# Altium schematic sheet CPU.SchDoc
size A4
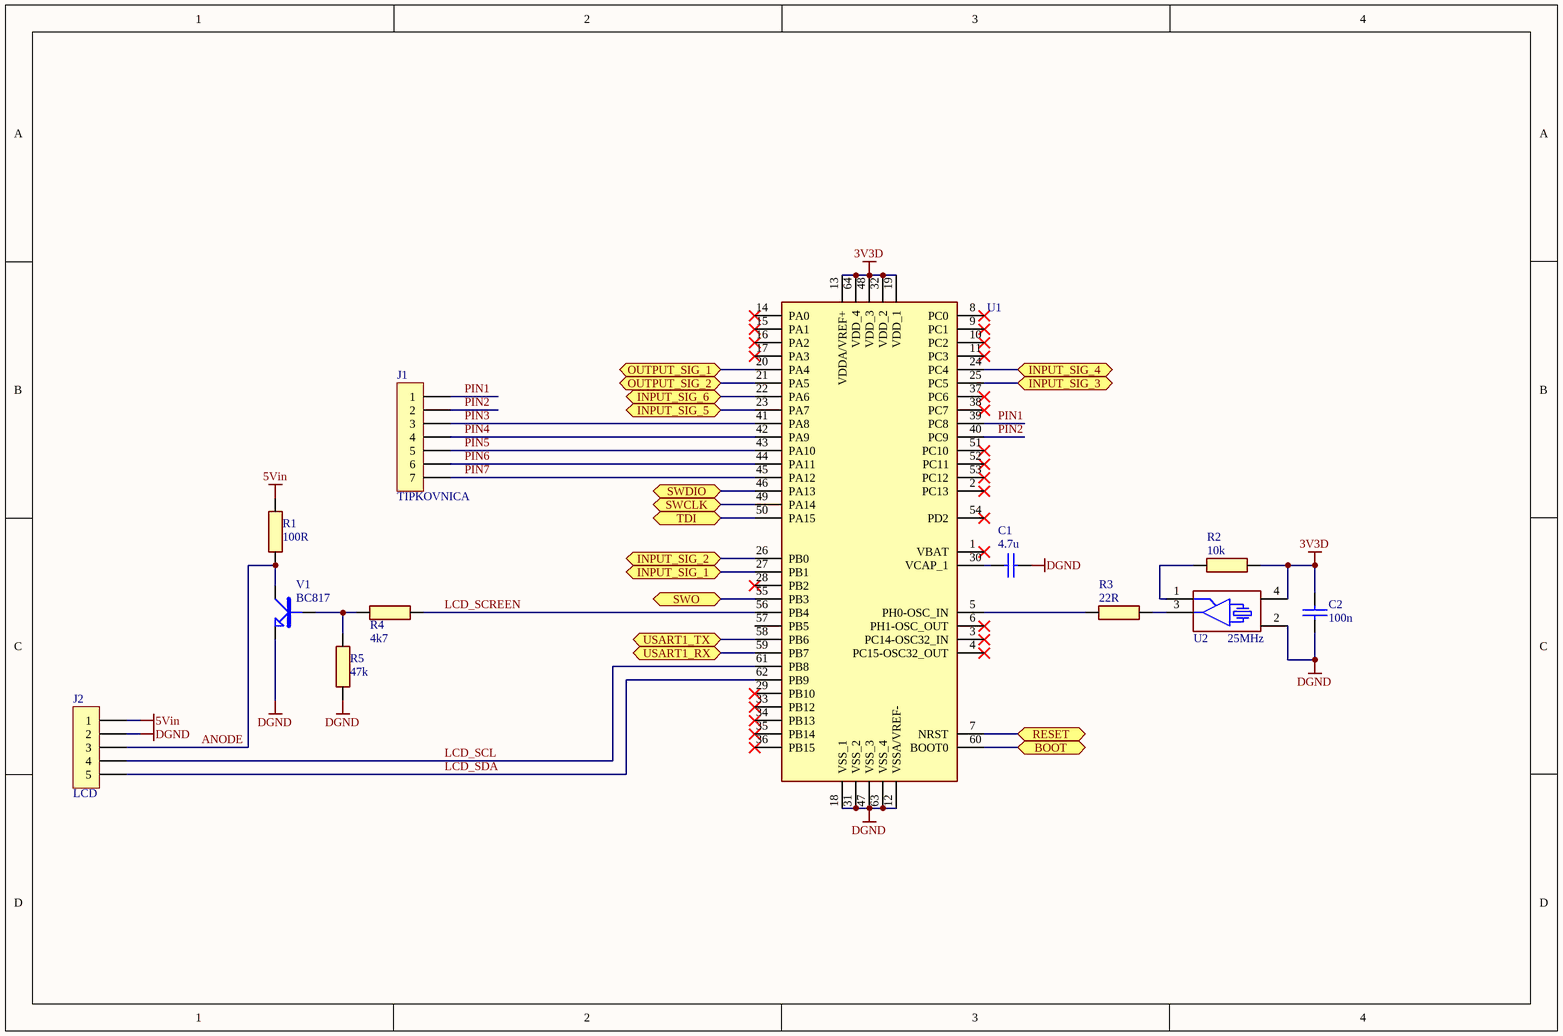
[diagram p0: CPU.SchDoc]

## Parts
C1  4.7u  [CAP_0805_SMD]
C2  100n  [CAP_0805_SMD]
J1  TIPKOVNICA  [CON-SIP-7]
J2  LCD  [CON-SIP-5]
R1  100R  [RES_0805_SMD]
R2  10k  [RES_0805_SMD]
R3  22R  [RES_0805_SMD]
R4  4k7  [RES_0805_SMD]
R5  47k  [RES_0805_SMD]
U1  STM32F446RE  [STM32F446RE]  (value not drawn)
U2  25MHz  [AQ-7050]
V1  BC817  [SOT-23_P]

## Ports
BOOT (bidir), INPUT_SIG_1 (bidir), INPUT_SIG_2 (bidir), INPUT_SIG_3 (bidir), INPUT_SIG_4 (bidir), INPUT_SIG_5 (bidir), INPUT_SIG_6 (bidir), OUTPUT_SIG_1 (bidir), OUTPUT_SIG_2 (bidir), RESET (bidir), SWCLK (bidir), SWDIO (bidir), SWO (bidir), TDI (bidir), USART1_RX (bidir), USART1_TX (bidir)

## Nets
3V3D: C2.2 R2.1 U1.13(VDDA/VREF+) U1.19(VDD_1) U1.32(VDD_2) U1.48(VDD_3) U1.64(VDD_4) U2.4(Vcc)
5Vin: J2.1 R1.2
DGND: C1.2 C2.1 J2.2 R5.1 U1.12(VSSA/VREF-) U1.18(VSS_1) U1.31(VSS_2) U1.47(VSS_3) U1.63(VSS_4) U2.2(DGND) V1.2(E)
ANODE: J2.3 R1.1 V1.3(C)
BOOT: U1.60(BOOT0) ; port BOOT
INPUT_SIG_1: U1.27(PB1) ; port INPUT_SIG_1
INPUT_SIG_2: U1.26(PB0) ; port INPUT_SIG_2
INPUT_SIG_3: U1.25(PC5) ; port INPUT_SIG_3
INPUT_SIG_4: U1.24(PC4) ; port INPUT_SIG_4
INPUT_SIG_5: U1.23(PA7) ; port INPUT_SIG_5
INPUT_SIG_6: U1.22(PA6) ; port INPUT_SIG_6
LCD_SCL: J2.4 U1.61(PB8)
LCD_SCREEN: R4.2 U1.56(PB4)
LCD_SDA: J2.5 U1.62(PB9)
OUTPUT_SIG_1: U1.20(PA4) ; port OUTPUT_SIG_1
OUTPUT_SIG_2: U1.21(PA5) ; port OUTPUT_SIG_2
PIN1: J1.1 U1.39(PC8)
PIN2: J1.2 U1.40(PC9)
PIN3: J1.3 U1.41(PA8)
PIN4: J1.4 U1.42(PA9)
PIN5: J1.5 U1.43(PA10)
PIN6: J1.6 U1.44(PA11)
PIN7: J1.7 U1.45(PA12)
RESET: U1.7(NRST) ; port RESET
SWCLK: U1.49(PA14) ; port SWCLK
SWDIO: U1.46(PA13) ; port SWDIO
SWO: U1.55(PB3) ; port SWO
TDI: U1.50(PA15) ; port TDI
USART1_RX: U1.59(PB7) ; port USART1_RX
USART1_TX: U1.58(PB6) ; port USART1_TX
NetC1_1: C1.1 U1.30(VCAP_1)
NetR2_2: R2.2 U2.1(PV)
NetR3_1: R3.1 U2.3(Out)
NetR3_2: R3.2 U1.5(PH0-OSC_IN)
NetR4_1: R4.1 R5.2 V1.1(B)

Not connected (* = marked no-connect by the designer): U1 1(VBAT)* 2(PC13)* 3(PC14-OSC32_IN)* 4(PC15-OSC32_OUT)* 6(PH1-OSC_OUT)* 8(PC0)* 9(PC1)* 10(PC2)* 11(PC3)* 14(PA0)* 15(PA1)* 16(PA2)* 17(PA3)* 28(PB2)* 29(PB10)* 33(PB12)* 34(PB13)* 35(PB14)* 36(PB15)* 37(PC6)* 38(PC7)* 51(PC10)* 52(PC11)* 53(PC12)* 54(PD2)* 57(PB5)

## Library data of the parts
C1 C2 = CAP: 0805
J1 = CON7: 7 Pin connector
J2 = CON5: 5 Pin connector
R1-R5 = RES: 0805
U1 = STM32F446RE: STM microcontroller
U2 = OSCILATOR: Oscillator
V1 = BC817: NPN tranzistor BC-817